# Altium project 大功率步进电机驱动器.PRJPCB
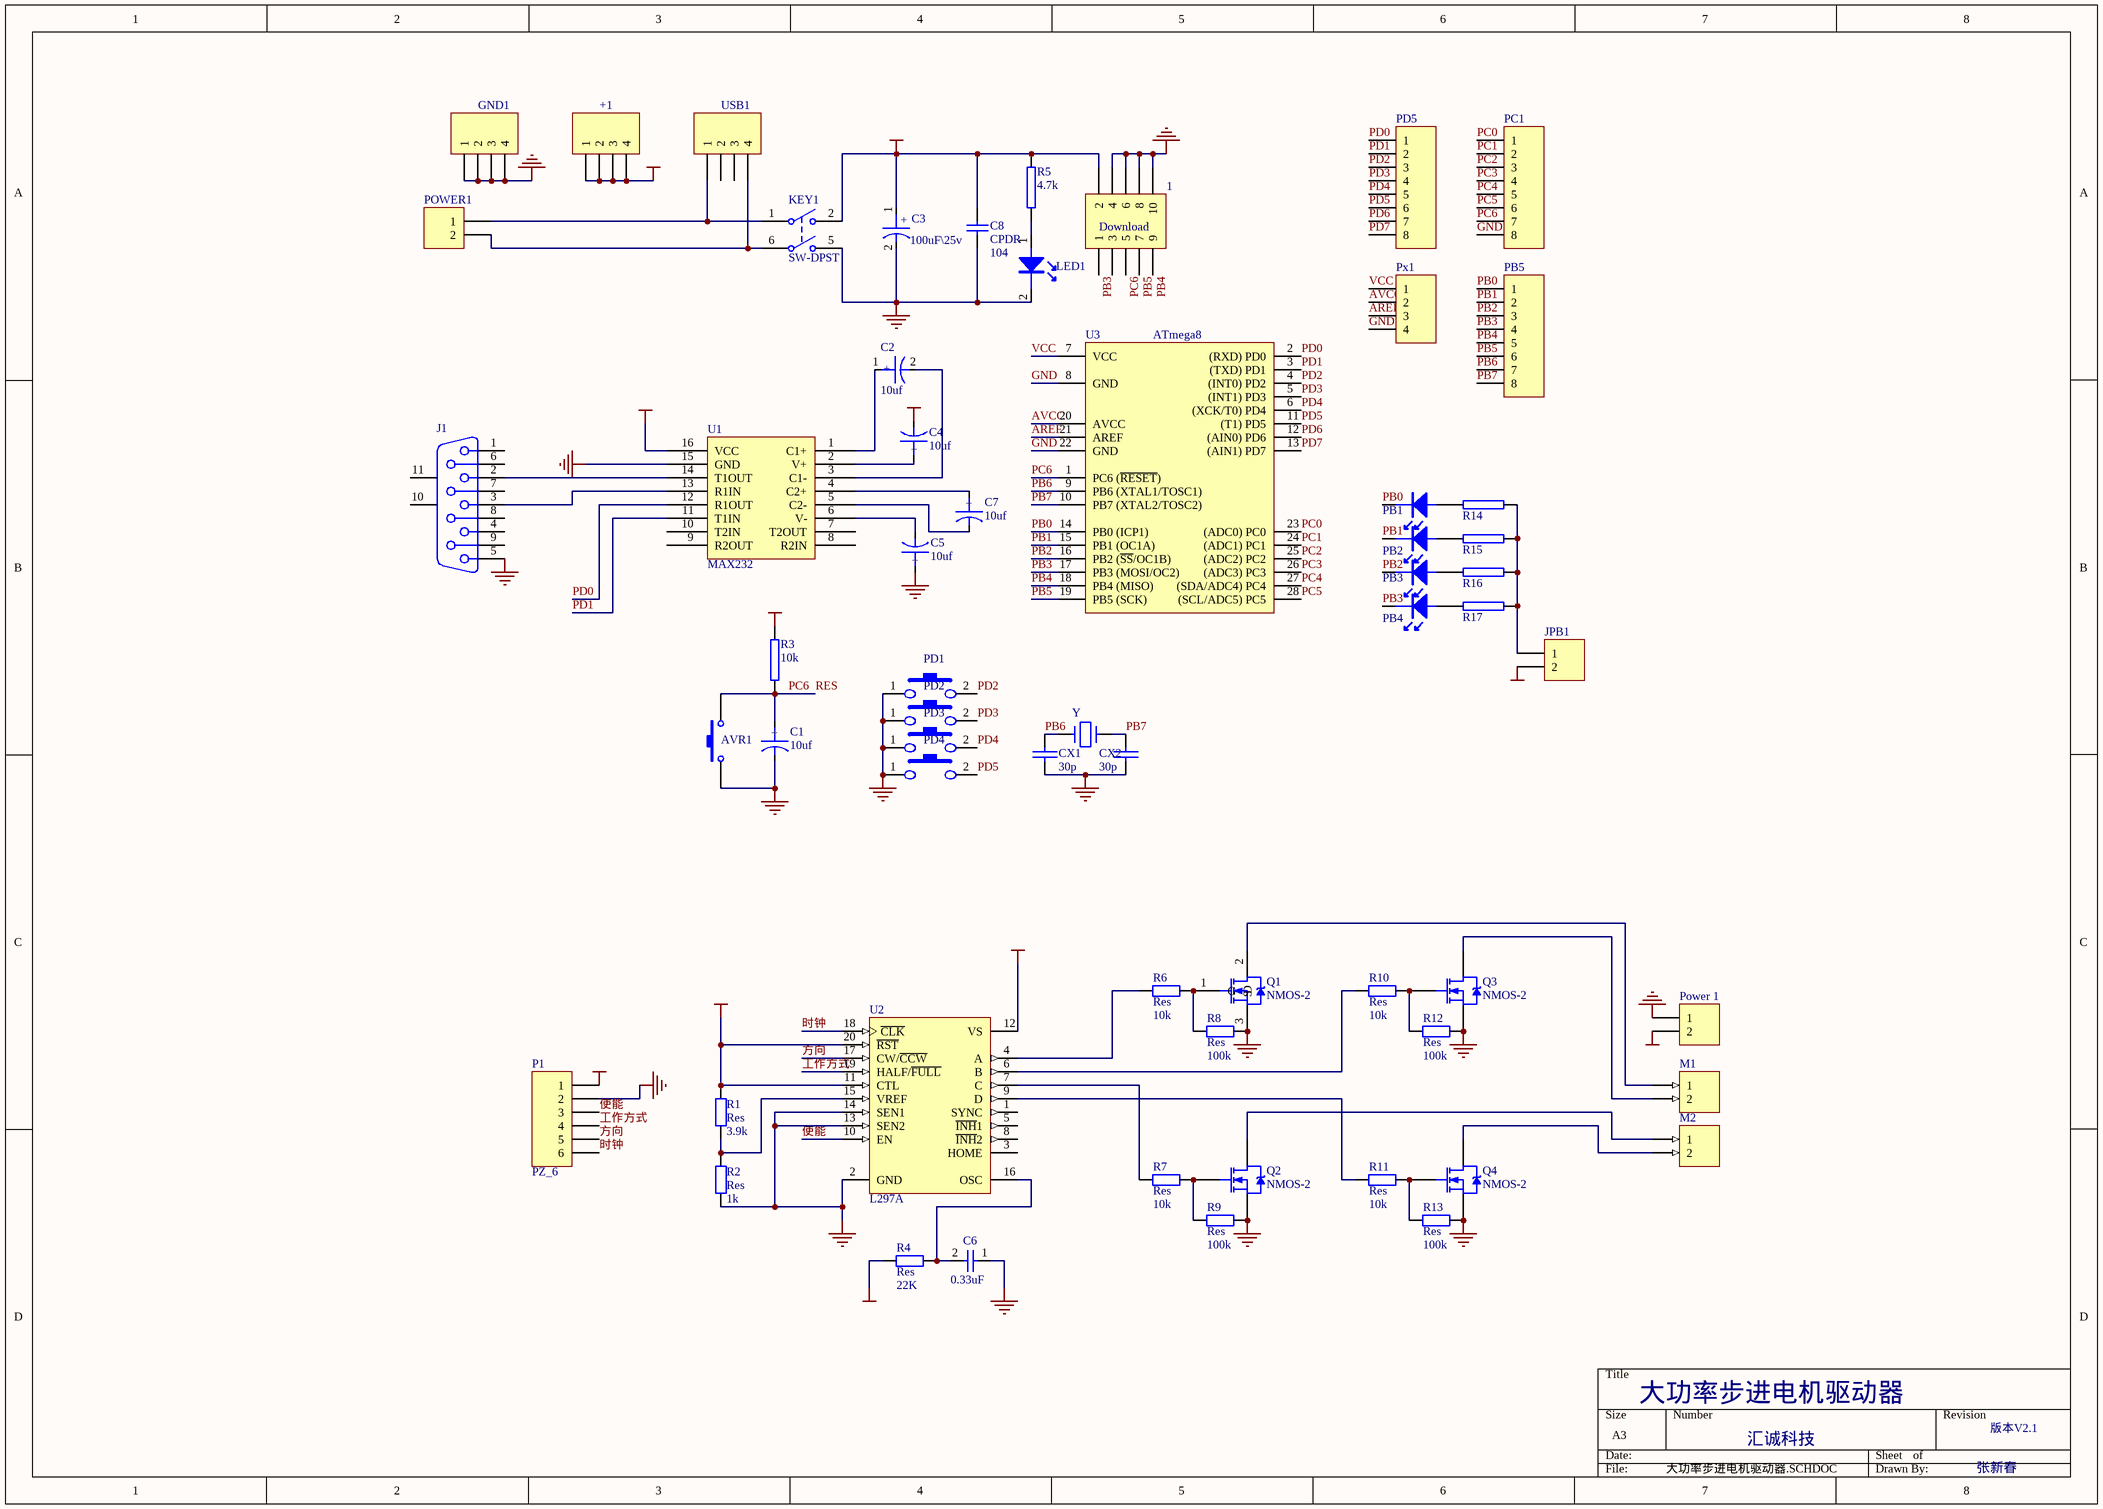
[diagram p0: 大功率步进电机驱动器.SCHDOC]
1 sheet, 61 parts. Net scope: global (net labels, ports and power ports of the same name join across sheets).
Board file: 大功率步进电机驱动器.PCBDOC

## Sheet 大功率步进电机驱动器.SCHDOC
size A3

### Parts
1  Download  [HDR-2x5]
+1  (no value)  [HDR1X4]
AVR1  (no value)  [an-6*6]
C1  10uf  [C-DJ-4]
C2  10uf  [C-DJ-4]
C3  100uF\25v  [C-DJ-6]
C4  10uf  [C-DJ-4]
C5  10uf  [C-DJ-4]
C6  value 0.33uF  [C-DJ-4]
C7  10uf  [C-DJ-4]
C8  CPDR  value 104  [CPDR]
CX1  30p  [HDR1X2]
CX2  30p  [HDR1X2]
GND1  (no value)  [HDR1X4]
J1  D Connector 9  [DSUB1.385-2H9]  (value not drawn)
JPB1  (no value)  [HDR1X2]
KEY1  SW-DPST  [DPDT-6]
LED1  LED  [LED]  (value not drawn)
M1  (no value)  [JK128]
M2  (no value)  [JK128]
P1  PZ_6  [HDR-6]
PB1  LED  [HDR1X2]  (value not drawn)
PB2  LED  [HDR1X2]  (value not drawn)
PB3  LED  [HDR1X2]  (value not drawn)
PB4  LED  [HDR1X2]  (value not drawn)
PB5  (no value)  [HDR-8]
PC1  (no value)  [HDR-8]
PD1  key1  [an-6*6]  (value not drawn)
PD2  key2  [an-6*6]  (value not drawn)
PD3  key3  [an-6*6]  (value not drawn)
PD4  key4  [an-6*6]  (value not drawn)
PD5  (no value)  [HDR-8]
POWER1  (no value)  [JK128]
Power_1  (no value)  [JK128]
Px1  (no value)  [HDR-4]
Q1  NMOS-2  [SFM-T3/A4.7V]
Q2  NMOS-2  [SFM-T3/A4.7V]
Q3  NMOS-2  [SFM-T3/A4.7V]
Q4  NMOS-2  [SFM-T3/A4.7V]
R1  Res  value 3.9k  [CPDR]
R2  Res  value 1k  [CPDR]
R3  10k  [RSE]
R4  Res  value 22K  [CPDR]
R5  4.7k  [RSE]
R6  Res  value 10k  [CPDR]
R7  Res  value 10k  [CPDR]
R8  Res  value 100k  [CPDR]
R9  Res  value 100k  [CPDR]
R10  Res  value 10k  [CPDR]
R11  Res  value 10k  [CPDR]
R12  Res  value 100k  [CPDR]
R13  Res  value 100k  [CPDR]
R14  470  [RSE]  (value not drawn)
R15  470  [RSE]  (value not drawn)
R16  470  [RSE]  (value not drawn)
R17  470  [RSE]  (value not drawn)
U1  MAX232  [DIP16]
U2  L297A  [DIP20]
U3  ATmega8  [底座DIP-28/引脚7.62mm]
USB1  (no value)  [USB-5V]
Y1  Y  [JZ_ZC]

### Nets
+5V: P1.1 R1.1 R4.2 U2.11(CTL) U2.12(VS) U2.20(~{RST})
GND: 1.4 1.6 1.8 1.10 AVR1.2 C1.2 C3.2 C5.1 C8.1 CX1.2 CX2.2 GND1.1 GND1.2 GND1.3 GND1.4 J1.5 KEY1.5(NO2) LED1.2(K) P1.2 PC1.8 PD1.1 PD2.1 PD3.1 PD4.1 Power_1.1 Px1.4 Q1.3(S) Q2.3(S) Q3.3(S) Q4.3(S) R2.2 R8.2 R9.2 R12.2 R13.2 U1.15(GND) U2.2(GND) U2.13(SEN2) U2.14(SEN1) U3.8(GND) U3.22(GND)
GND-12: C6.1
VCC: 1.2 +1.1 +1.2 +1.3 +1.4 C3.1 C4.2 C8.2 JPB1.2 KEY1.2(NO1) Power_1.2 Px1.1 R3.2 R5.1 U1.16(VCC) U3.7(VCC)
AREF: Px1.3 U3.21(AREF)
AVCC: Px1.2 U3.20(AVCC)
PB0: PB1.2(K) PB5.1 U3.14(PB0_(ICP1))
PB1: PB2.2(K) PB5.2 U3.15(PB1_(OC1A))
PB2: PB3.2(K) PB5.3 U3.16(PB2_(~{SS}/OC1B))
PB3: 1.1 PB4.2(K) PB5.4 U3.17(PB3_(MOSI/OC2))
PB4: 1.9 PB5.5 U3.18(PB4_(MISO))
PB5: 1.7 PB5.6 U3.19(PB5_(SCK))
PB6: CX1.1 PB5.7 U3.9(PB6_(XTAL1/TOSC1)) Y1.2
PB7: CX2.1 PB5.8 U3.10(PB7_(XTAL2/TOSC2)) Y1.1
PC0: PC1.1 U3.23((ADC0)_PC0)
PC1: PC1.2 U3.24((ADC1)_PC1)
PC2: PC1.3 U3.25((ADC2)_PC2)
PC3: PC1.4 U3.26((ADC3)_PC3)
PC4: PC1.5 U3.27((SDA/ADC4)_PC4)
PC5: PC1.6 U3.28((SCL/ADC5)_PC5)
PC6: 1.5 AVR1.1 C1.1 PC1.7 R3.1 U3.1(PC6_(~{RESET}))  [also labelled RES]
PD0: PD5.1 U1.12(R1OUT) U3.2((RXD)_PD0)
PD1: PD5.2 U1.11(T1IN) U3.3((TXD)_PD1)
PD2: PD1.2 PD5.3 U3.4((INT0)_PD2)
PD3: PD2.2 PD5.4 U3.5((INT1)_PD3)
PD4: PD3.2 PD5.5 U3.6((XCK/T0)_PD4)
PD5: PD4.2 PD5.6 U3.11((T1)_PD5)
PD6: PD5.7 U3.12((AIN0)_PD6)
PD7: PD5.8 U3.13((AIN1)_PD7)
使能: P1.3 U2.10(EN)
工作方式: P1.4 U2.19(HALF/~{FULL})
方向: P1.5 U2.17(CW/~{CCW})
时钟: P1.6 U2.18(~{CLK})
NetC2_1: C2.1 U1.1(C1+)
NetC2_2: C2.2 U1.3(C1-)
NetC4_1: C4.1 U1.2(V+)
NetC5_2: C5.2 U1.6(V-)
NetC6_2: C6.2 R4.1 U2.16(OSC)
NetC7_1: C7.1 U1.4(C2+)
NetC7_2: C7.2 U1.5(C2-)
NetJ1_2: J1.2 U1.14(T1OUT)
NetJ1_3: J1.3 U1.13(R1IN)
NetJPB1_1: JPB1.1 R14.1 R15.1 R16.1 R17.1
NetKEY1_1: KEY1.1(COMMON1) POWER1.1 USB1.1
NetKEY1_6: KEY1.6(COMMON2) POWER1.2 USB1.4
NetLED1_1: LED1.1(A) R5.2
NetM1_1: M1.1 Q1.2(D)
NetM1_2: M1.2 Q3.2(D)
NetM2_1: M2.1 Q2.2(D)
NetM2_2: M2.2 Q4.2(D)
NetPB1_1: PB1.1(A) R14.2
NetPB2_1: PB2.1(A) R15.2
NetPB3_1: PB3.1(A) R16.2
NetPB4_1: PB4.1(A) R17.2
NetQ1_1: Q1.1(G) R6.1 R8.1
NetQ2_1: Q2.1(G) R7.1 R9.1
NetQ3_1: Q3.1(G) R10.1 R12.1
NetQ4_1: Q4.1(G) R11.1 R13.1
NetR1_2: R1.2 R2.1 U2.15(VREF)
NetR6_2: R6.2 U2.4(A)
NetR7_2: R7.2 U2.7(C)
NetR10_2: R10.2 U2.6(B)
NetR11_2: R11.2 U2.9(D)

Not connected (* = marked no-connect by the designer): 1 3; J1 1 4 6 7 8 9 10(MH1) 11(MH2); U1 7(T2OUT) 8(R2IN) 9(R2OUT) 10(T2IN); U2 1(SYNC) 3(HOME) 5(~{INH}1) 8(~{INH}2); USB1 2 3

### Notes on the sheet
- 大功率步进电机驱动器
- 汇诚科技
- 版本V2.1
- 张新春
- (in symbol CAPACITOR POL) +

### Library data of the parts
1 = Header 5X2: Header, 5-Pin, Dual row; Revision: 17-Jul-2002: Re-released for DXP Platform.; Publisher: Altium Limited
+1 GND1 USB1 = Header 4: Header, 4-Pin; Revision: 17-Jul-2002: Re-released for DXP Platform.; Publisher: Altium Limited
AVR1 = SW-PB: Switch; Published: 24-Mar-1999; LatestRevisionDate: 17-Jul-2002; LatestRevisionNote: Re-released for DXP Platform.; Publisher: Altium Limited
C1-C5 C7 = CAPACITOR POL: Capacitor
C6 = Cap: Capacitor; Published: 8-Jun-2000; LatestRevisionDate: 17-Jul-2002; LatestRevisionNote: Re-released for DXP Platform.; Publisher: Altium Limited
C8 = CPDR: 瓷片电容; Published: 8-Jun-2000; LatestRevisionDate: 17-Jul-2002; LatestRevisionNote: Re-released for DXP Platform.; Publisher: Altium Limited
CX1 CX2 = CAP: Capacitor
J1 = D Connector 9: Receptacle Assembly, 9 Position, Right Angle; Package Information: Latest Revision: O; Positions: 9; Published: 15-Jun-2001; Revision: 17-Jul-2002: Re-released for DXP Platform.; Datasheet: (1-Sep-1999); Package Reference: 788750; Publisher: Altium Limited; Orientation: Right Angle; Gender: Receptacle
JPB1 POWER1 = Header 2: Header, 2-Pin; LatestRevisionDate: 17-Jul-2002; LatestRevisionNote: Re-released for DXP Platform.; Publisher: Altium Limited
KEY1 = SW-DPST: Double-Pole, Single-Throw Switch; Published: 24-Mar-1999; Revision: July-2002: Re-released for DXP Platform.; Publisher: Altium Limited
M1 M2 Power_1 = MHDR1X2: Header, 2-Pin; LatestRevisionDate: 17-Jul-2002; LatestRevisionNote: Re-released for DXP Platform.; Publisher: Altium Limited
P1 = PZ_6: 排针——6; LatestRevisionDate: 17-Jul-2002; LatestRevisionNote: Re-released for DXP Platform.; Publisher: Altium Limited
PB5 PC1 PD5 = PZ_8: 排针——8; LatestRevisionDate: 17-Jul-2002; LatestRevisionNote: Re-released for DXP Platform.; Publisher: Altium Limited
PD1-PD4 = key
Px1 = PZ_4: 排针——4; LatestRevisionDate: 17-Jul-2002; LatestRevisionNote: Re-released for DXP Platform.; Publisher: Altium Limited
Q1-Q4 = NMOS-2: N-Channel Power MOSFET; Note: Pin 2 is electrically connected to pin 4.; Published: 8-Jun-2000; LatestRevisionDate: 17-Jul-2002; LatestRevisionNote: Re-released for DXP Platform.; DatasheetDocument: PD-9.814; PackageReference: TO-220AB; Publisher: Altium Limited; Code_JEDEC: TO-220-AB
R1 R2 R4 R6-R13 = Res: 电阻; Published: 8-Jun-2000; LatestRevisionDate: 17-Jul-2002; LatestRevisionNote: Re-released for DXP Platform.; Publisher: Altium Limited
R3 R5 R14-R17 = RES2
U2 = L297A: Stepper Motor Controller; Published: 8-Jun-2000; LatestRevisionDate: 6-Jun-2005; LatestRevisionNote: Stylized 3D Model Added.; DatasheetDocument: Aug-1996; PackageDocument: Jun-1998; PackageReference: DIP20; Publisher: Altium Limited; Code_JEDEC: MS-015-AE; ComponentLink1Description: Manufacturer Link; ComponentLink1URL: http://www.st.com/
U3 = ATmega8-P: 8 位微处理器/28引脚; 子类别: 微处理器; 发布者: 磊元工作室; 发布日期: 2003年8月18日; 制造商: Atmel Corporation; 类别: 集成电路; 元件名称（国标）: 8 位微处理器; 元件名称（英文）: 8-bit Microcontroller; 特性:存储器容量: Flash：8KB ，EEPROM：512B ，RAM：1KB; 特性:定时器/计数器: 2 个 8-bit ，1 个 16-bit; 特性:模/数转换器: 6 通道 10-bit ADC; 特性:指令: 两个时钟周期的硬件乘法器
Y1 = CRYSTAL